# EAGLE schematic Voltage_Regulator_Design (EAGLE 9.6.2)
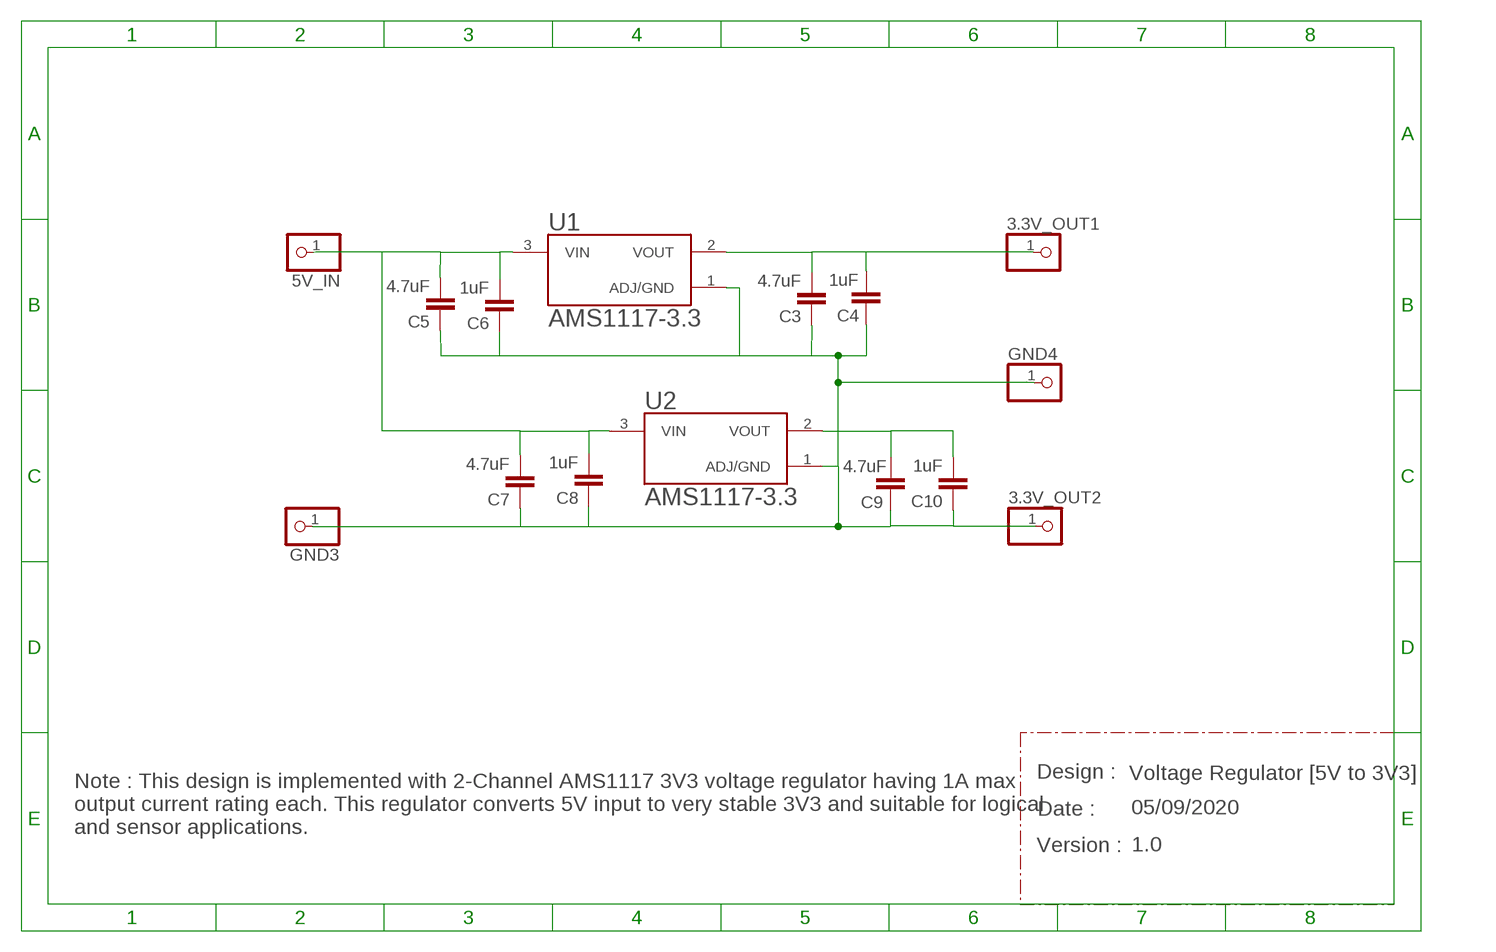
[diagram p0: schematic, sheet 1]

## Parts
3.3V_OUT1  PINHD-1X1  [1X01]
3.3V_OUT2  PINHD-1X1  [1X01]
5V_IN  PINHD-1X1  [1X01]
C3  4.7uF  C-EUC0805  [C0805]
C4  1uF  C-EUC0805  [C0805]
C5  4.7uF  C-EUC0805  [C0805]
C6  1uF  C-EUC0805  [C0805]
C7  4.7uF  C-EUC0805  [C0805]
C8  1uF  C-EUC0805  [C0805]
C9  4.7uF  C-EUC0805  [C0805]
C10  1uF  C-EUC0805  [C0805]
GND3  PINHD-1X1  [1X01]
GND4  PINHD-1X1  [1X01]
U1  AMS1117-3.3  [SOT229P700X180-4N]
U2  AMS1117-3.3  [SOT229P700X180-4N]

## Nets
N$6: 3.3V_OUT1.1 C3.2 C4.2 U1.2(VOUT)
N$7: C9.2 C10.2 U2.2(VOUT)
N$9: 5V_IN.1 C5.2 C6.2 C7.2 C8.2 U1.3(VIN) U2.3(VIN)
N$10: 3.3V_OUT2.1 C4.1 C5.1 C6.1 C7.1 C8.1 C9.1 C10.1 GND3.1 GND4.1 U1.1(ADJ/GND) U2.1(ADJ/GND)
N$12: C3.1

## Notes on the sheet
- Design : | Voltage Regulator [5V to 3V3]
- Date : | 05/09/2020
- Note : This design is implemented with 2-Channel AMS1117 3V3 voltage regulator having 1A max
  output current rating each. This regulator converts 5V input to very stable 3V3 and suitable for logical
  and sensor applications.
- Version : | 1.0

## Library data of the parts
3.3V_OUT1 3.3V_OUT2 5V_IN GND3 GND4 = adafruit:PINHD-1X1: Pin header 1x1 for 0.1" spacing With round pins
C3-C10 = rcl:C-EU: CAPACITOR, European symbol; SPICEPREFIX: C
U1 U2 = AMS1117-3.3:AMS1117-3.3: Sot223/Pkg 1-Amp 3.3-Volt Low Drop Out Voltage Regulatator; AVAILABILITY: Unavailable; DESCRIPTION: Sot223/Pkg 1-Amp 3.3-Volt Low Drop Out Voltage Regulatator; MF: Advanced Monolithic Systems; MP: AMS1117-3.3; PACKAGE: None; PRICE: None